# Altium schematic sheet node24-bank.SchDoc: Output Channel
size Tabloid; Author: Emergence Team; Engineer: asheem; Organization: Emergence; Address1: Oakland, California; Address2: a@aliengeometry.com; Address3: Black Rock City '18; Address4: OPEN SOURCE H/W; DocumentNumber: 3; Revision: Rev 0.1; SheetNumber: 3; SheetTotal: 6; Project: NODE24
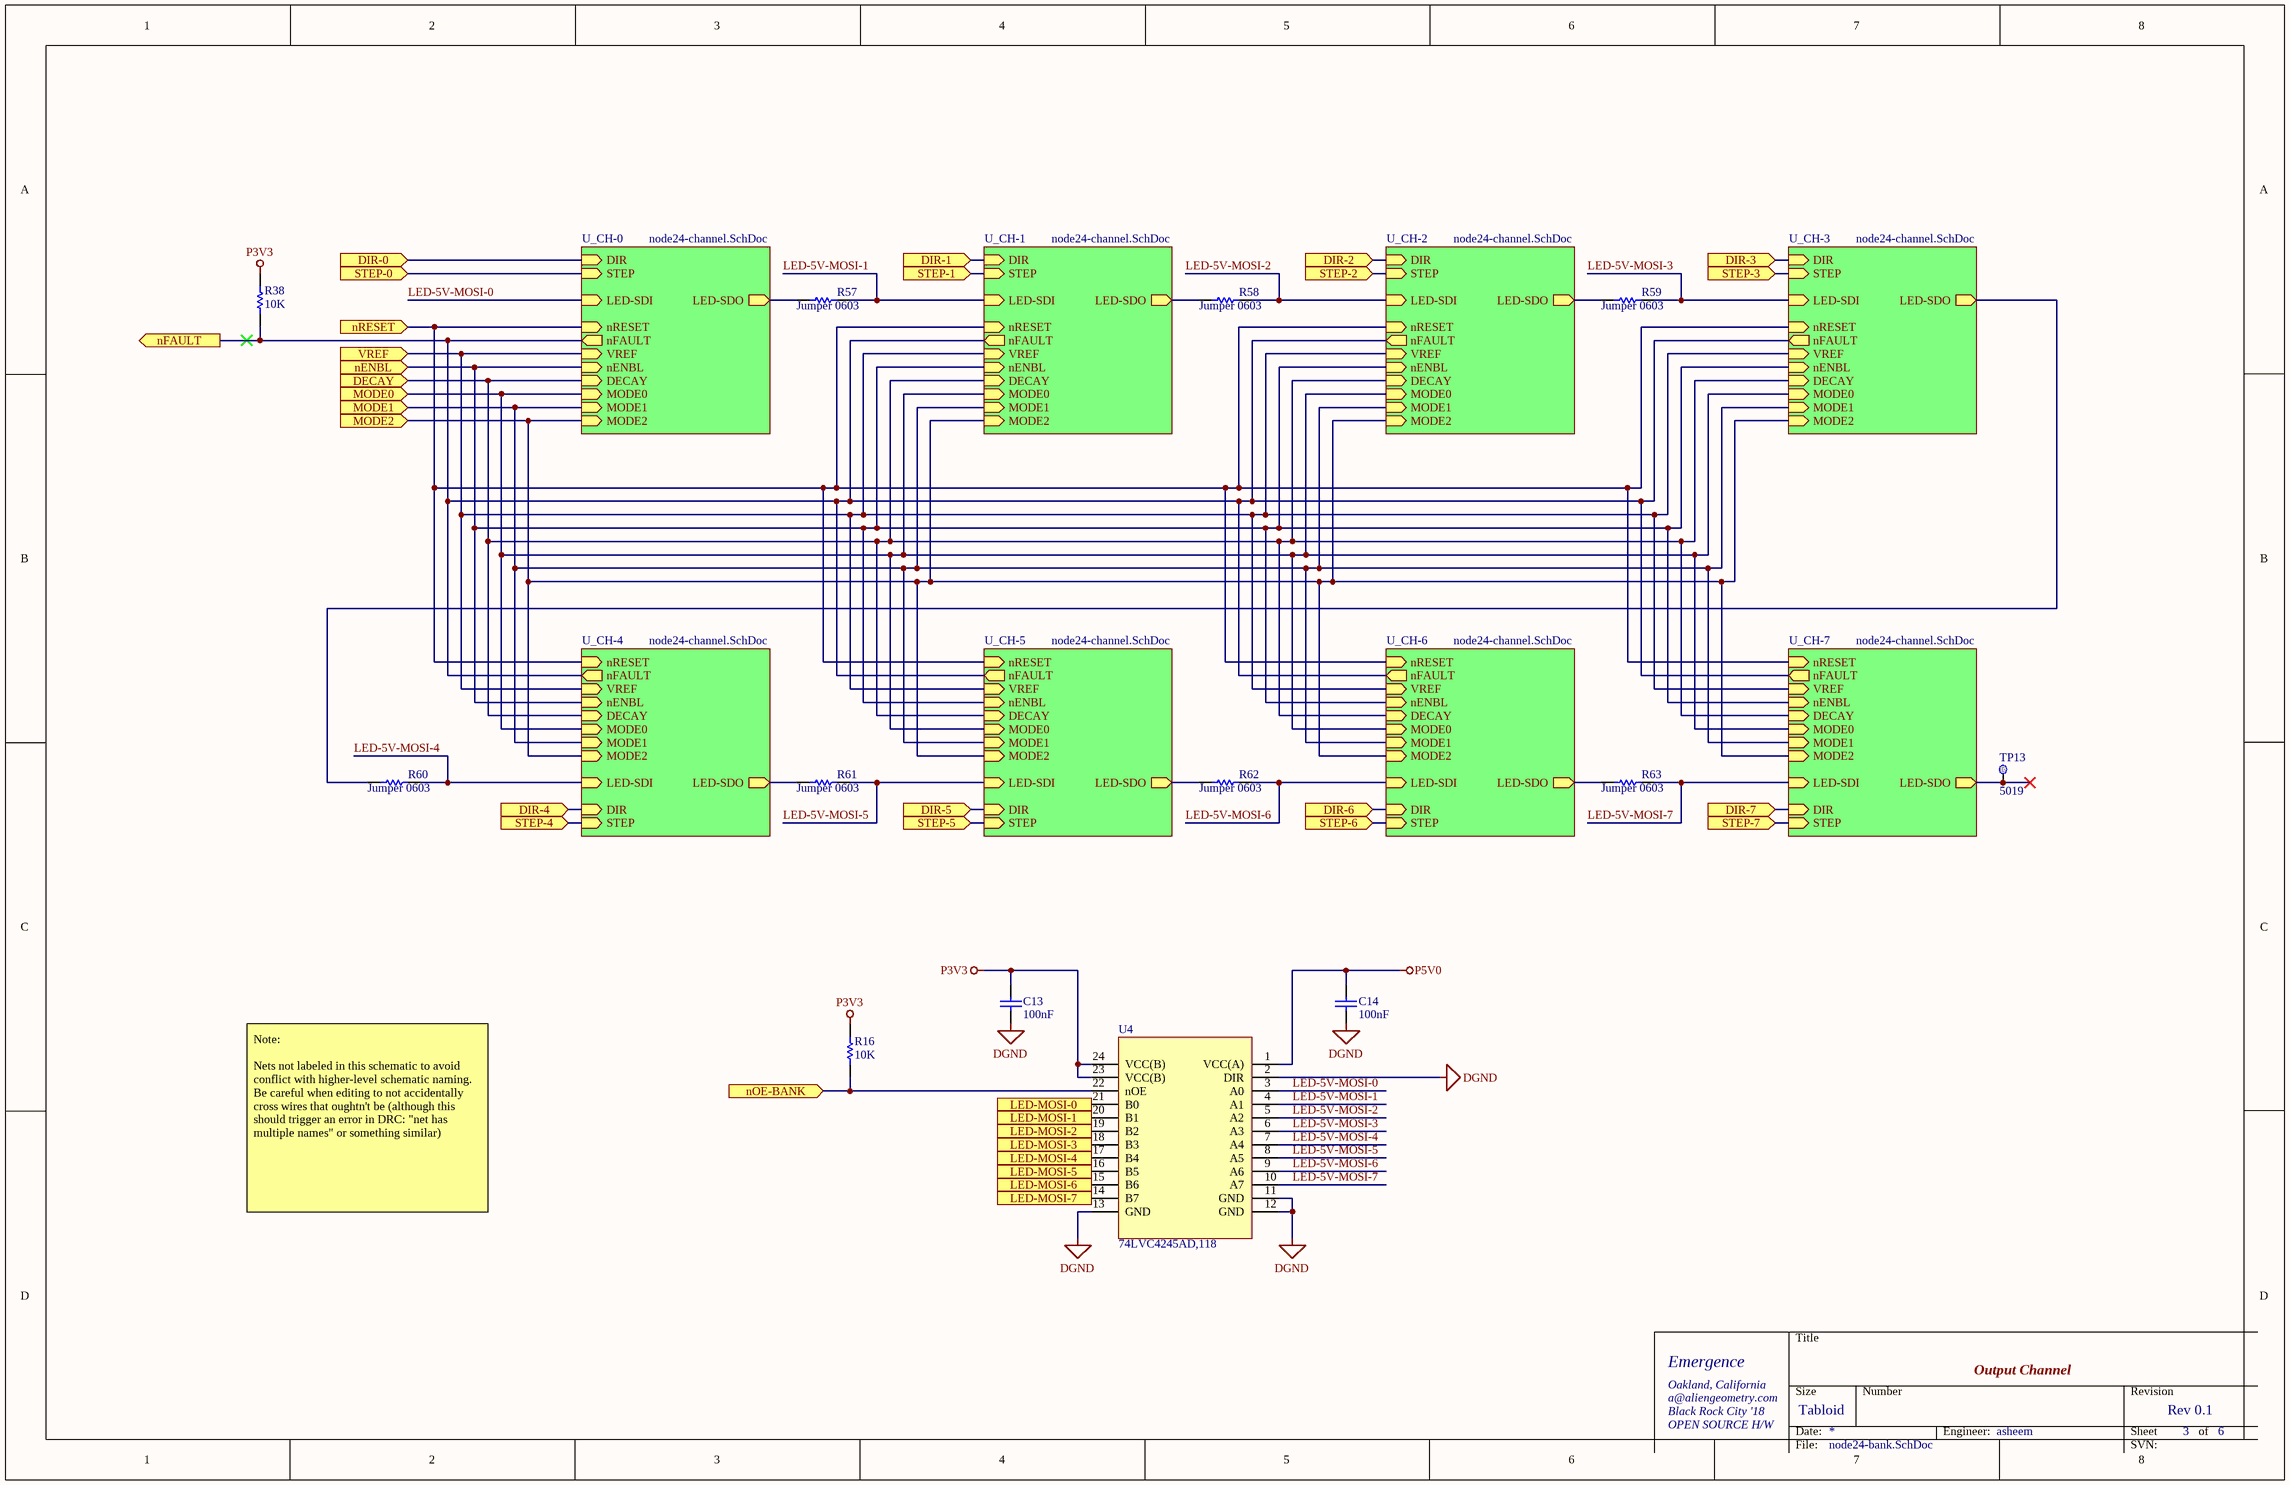
[diagram p0: node24-bank.SchDoc]

## Parts
C13  100nF  [CAPC0603(1608)100_L]
C14  100nF  [CAPC0603(1608)100_L]
R16  10K  [RESC0603(1608)_L]
R38  10K  [RESC0603(1608)_L]
R57  Jumper 0603  [RESC0603(1608)_L]
R58  Jumper 0603  [RESC0603(1608)_L]
R59  Jumper 0603  [RESC0603(1608)_L]
R60  Jumper 0603  [RESC0603(1608)_L]
R61  Jumper 0603  [RESC0603(1608)_L]
R62  Jumper 0603  [RESC0603(1608)_L]
R63  Jumper 0603  [RESC0603(1608)_L]
TP13  Manufacturer Part Number: 5019  [TEST_POINT_KEYSTONE_5019]  (hidden comment: TEST_POINT_KEYSTONE_5019_SMT)
U4  74LVC4245AD,118  [IC_TSSOP-24]

## Sub-sheets
U_CH-0 = node24-channel.SchDoc: VREF (in), nENBL (in), STEP (in), DIR (in), DECAY (in), MODE0 (in), MODE1 (in), MODE2 (in), nRESET (in), nFAULT (out), LED-SDI (in), LED-SDO (out)
U_CH-1 = node24-channel.SchDoc: VREF (in), nENBL (in), STEP (in), DIR (in), DECAY (in), MODE0 (in), MODE1 (in), MODE2 (in), nRESET (in), nFAULT (out), LED-SDI (in), LED-SDO (out)
U_CH-2 = node24-channel.SchDoc: VREF (in), nENBL (in), STEP (in), DIR (in), DECAY (in), MODE0 (in), MODE1 (in), MODE2 (in), nRESET (in), nFAULT (out), LED-SDI (in), LED-SDO (out)
U_CH-3 = node24-channel.SchDoc: VREF (in), nENBL (in), STEP (in), DIR (in), DECAY (in), MODE0 (in), MODE1 (in), MODE2 (in), nRESET (in), nFAULT (out), LED-SDI (in), LED-SDO (out)
U_CH-4 = node24-channel.SchDoc: VREF (in), nENBL (in), STEP (in), DIR (in), DECAY (in), MODE0 (in), MODE1 (in), MODE2 (in), nRESET (in), LED-SDI (in), LED-SDO (out), nFAULT (out)
U_CH-5 = node24-channel.SchDoc: VREF (in), nENBL (in), STEP (in), DIR (in), DECAY (in), MODE0 (in), MODE1 (in), MODE2 (in), nRESET (in), LED-SDI (in), LED-SDO (out), nFAULT (out)
U_CH-6 = node24-channel.SchDoc: VREF (in), nENBL (in), STEP (in), DIR (in), DECAY (in), MODE0 (in), MODE1 (in), MODE2 (in), nRESET (in), LED-SDI (in), LED-SDO (out), nFAULT (out)
U_CH-7 = node24-channel.SchDoc: VREF (in), nENBL (in), STEP (in), DIR (in), DECAY (in), MODE0 (in), MODE1 (in), MODE2 (in), nRESET (in), LED-SDI (in), LED-SDO (out), nFAULT (out)

## Ports
DECAY (in), DIR-0 (in), DIR-1 (in), DIR-2 (in), DIR-3 (in), DIR-4 (in), DIR-5 (in), DIR-6 (in), DIR-7 (in), LED-MOSI-0 (in), LED-MOSI-1 (in), LED-MOSI-2 (in), LED-MOSI-3 (in), LED-MOSI-4 (in), LED-MOSI-5 (in), LED-MOSI-6 (in), LED-MOSI-7 (in), MODE0 (in), MODE1 (in), MODE2 (in), nENBL (in), nFAULT (out), nOE-BANK (in), nRESET (in), STEP-0 (in), STEP-1 (in), STEP-2 (in), STEP-3 (in), STEP-4 (in), STEP-5 (in), STEP-6 (in), STEP-7 (in), VREF (in)

## Nets
DGND: C13.2 C14.2 U4.2(DIR) U4.11(GND) U4.12(GND) U4.13(GND)
P3V3: C13.1 R16.2 R38.2 U4.23(VCC(B)) U4.24(VCC(B))
P5V0: C14.1 U4.1(VCC(A))
DECAY: port DECAY, sheet U_CH-0/DECAY, sheet U_CH-4/DECAY, sheet U_CH-1/DECAY, sheet U_CH-5/DECAY, sheet U_CH-2/DECAY, sheet U_CH-6/DECAY, sheet U_CH-3/DECAY, sheet U_CH-7/DECAY
DIR-0: port DIR-0, sheet U_CH-0/DIR
DIR-1: port DIR-1, sheet U_CH-1/DIR
DIR-2: port DIR-2, sheet U_CH-2/DIR
DIR-3: port DIR-3, sheet U_CH-3/DIR
DIR-4: port DIR-4, sheet U_CH-4/DIR
DIR-5: port DIR-5, sheet U_CH-5/DIR
DIR-6: port DIR-6, sheet U_CH-6/DIR
DIR-7: port DIR-7, sheet U_CH-7/DIR
LED-5V-MOSI-0: U4.3(A0) ; sheet U_CH-0/LED-SDI
LED-5V-MOSI-1: R57.2 U4.4(A1) ; sheet U_CH-1/LED-SDI
LED-5V-MOSI-2: R58.2 U4.5(A2) ; sheet U_CH-2/LED-SDI
LED-5V-MOSI-3: R59.2 U4.6(A3) ; sheet U_CH-3/LED-SDI
LED-5V-MOSI-4: R60.2 U4.7(A4) ; sheet U_CH-4/LED-SDI
LED-5V-MOSI-5: R61.2 U4.8(A5) ; sheet U_CH-5/LED-SDI
LED-5V-MOSI-6: R62.2 U4.9(A6) ; sheet U_CH-6/LED-SDI
LED-5V-MOSI-7: R63.2 U4.10(A7) ; sheet U_CH-7/LED-SDI
LED-MOSI-0: U4.21(B0) ; port LED-MOSI-0
LED-MOSI-1: U4.20(B1) ; port LED-MOSI-1
LED-MOSI-2: U4.19(B2) ; port LED-MOSI-2
LED-MOSI-3: U4.18(B3) ; port LED-MOSI-3
LED-MOSI-4: U4.17(B4) ; port LED-MOSI-4
LED-MOSI-5: U4.16(B5) ; port LED-MOSI-5
LED-MOSI-6: U4.15(B6) ; port LED-MOSI-6
LED-MOSI-7: U4.14(B7) ; port LED-MOSI-7
MODE0: port MODE0, sheet U_CH-0/MODE0, sheet U_CH-4/MODE0, sheet U_CH-1/MODE0, sheet U_CH-5/MODE0, sheet U_CH-2/MODE0, sheet U_CH-6/MODE0, sheet U_CH-3/MODE0, sheet U_CH-7/MODE0
MODE1: port MODE1, sheet U_CH-0/MODE1, sheet U_CH-4/MODE1, sheet U_CH-1/MODE1, sheet U_CH-5/MODE1, sheet U_CH-2/MODE1, sheet U_CH-6/MODE1, sheet U_CH-3/MODE1, sheet U_CH-7/MODE1
MODE2: port MODE2, sheet U_CH-0/MODE2, sheet U_CH-4/MODE2, sheet U_CH-1/MODE2, sheet U_CH-5/MODE2, sheet U_CH-2/MODE2, sheet U_CH-6/MODE2, sheet U_CH-3/MODE2, sheet U_CH-7/MODE2
nENBL: port nENBL, sheet U_CH-0/nENBL, sheet U_CH-4/nENBL, sheet U_CH-1/nENBL, sheet U_CH-5/nENBL, sheet U_CH-2/nENBL, sheet U_CH-6/nENBL, sheet U_CH-3/nENBL, sheet U_CH-7/nENBL
nFAULT: R38.1 ; port nFAULT, sheet U_CH-0/nFAULT, sheet U_CH-4/nFAULT, sheet U_CH-1/nFAULT, sheet U_CH-5/nFAULT, sheet U_CH-2/nFAULT, sheet U_CH-6/nFAULT, sheet U_CH-3/nFAULT, sheet U_CH-7/nFAULT
nOE-BANK: R16.1 U4.22(nOE) ; port nOE-BANK
nRESET: port nRESET, sheet U_CH-0/nRESET, sheet U_CH-4/nRESET, sheet U_CH-1/nRESET, sheet U_CH-5/nRESET, sheet U_CH-2/nRESET, sheet U_CH-6/nRESET, sheet U_CH-3/nRESET, sheet U_CH-7/nRESET
STEP-0: port STEP-0, sheet U_CH-0/STEP
STEP-1: port STEP-1, sheet U_CH-1/STEP
STEP-2: port STEP-2, sheet U_CH-2/STEP
STEP-3: port STEP-3, sheet U_CH-3/STEP
STEP-4: port STEP-4, sheet U_CH-4/STEP
STEP-5: port STEP-5, sheet U_CH-5/STEP
STEP-6: port STEP-6, sheet U_CH-6/STEP
STEP-7: port STEP-7, sheet U_CH-7/STEP
VREF: port VREF, sheet U_CH-0/VREF, sheet U_CH-4/VREF, sheet U_CH-1/VREF, sheet U_CH-5/VREF, sheet U_CH-2/VREF, sheet U_CH-6/VREF, sheet U_CH-3/VREF, sheet U_CH-7/VREF
NetR57_1: R57.1 ; sheet U_CH-0/LED-SDO
NetR58_1: R58.1 ; sheet U_CH-1/LED-SDO
NetR59_1: R59.1 ; sheet U_CH-2/LED-SDO
NetR60_1: R60.1 ; sheet U_CH-3/LED-SDO
NetR61_1: R61.1 ; sheet U_CH-4/LED-SDO
NetR62_1: R62.1 ; sheet U_CH-5/LED-SDO
NetR63_1: R63.1 ; sheet U_CH-6/LED-SDO
NetTP13_1: TP13.1 ; sheet U_CH-7/LED-SDO

## Notes on the sheet
- Note:
  Nets not labeled in this schematic to avoid conflict with higher-level schematic naming. Be careful when editing to not accidentally cross wires that oughtn't be (although this should trigger an error in DRC: "net has multiple names" or something similar)
- Title
- Size
- Date:
- Tabloid
- Number
- Engineer:
- Revision
- Sheet
- of
- File:
- SVN:

## Library data of the parts
C13 C14 = CMP-1035-02593-1: CAP 100nF 50V ±20% 0603 (1608 Metric) Thickness 1mm SMD; Tolerance: Â±20%; Case-EIA: 0603; Case-Metric: 1608; Max Thickness: 1 mm; Value: 100nF; Technology: SMT; Rated Voltage: 50 V
R16 R38 = CMP-1012-00623-1: 10K 0.1W 1% 0603 (1608 Metric)  SMD; Value: 10000.00 Ohm; Case-EIA: 0603; Case-Metric: 1608; Power: 0.1 W; Tolerance: 1 %; Technology: SMT
R57-R63 = CMP-1012-00001-1: Jumper 0603 (1608 Metric); Case-Metric: 1608; Value: 0.00 Ohm; Power: None; Case-EIA: 0603; Technology: SMT; Tolerance: None
TP13 = TEST_POINT_KEYSTONE_5019_SMT: Circuit Board Hardware - PCB TEST POINT; Manufacturer: Keystone Electronics; Supplier 1: Digi-Key; Stock 1: 207442; Pricing 1: 1=0.38, 10=0.355, 25=0.3044, 50=0.2586, 100=0.2485, 250=0.22316, 500=0.21302 (USD); Mount: Surface Mount,PCB; Number of Pins: 1; Contact Plating: Silver; Material: Bronze; Contact Material: Bronze; Packaging: Tape and Reel; Package Quantity: 1; Termination: SMD/SMT; Height: 0.09inch; REACH SVHC: No SVHC; Lead Free: Lead Free; ComponentLink1URL: https://datasheet.ciiva.com/14848/m60-2p61-14848437.pdf; ComponentLink1Description: https://datasheet.ciiva.com/14848/m60-2p61-14848437.pdf; ComponentLink2URL: https://datasheet.ciiva.com/14848/m60-2p61-14848438.pdf; ComponentLink2Description: https://datasheet.ciiva.com/14848/m60-2p61-14848438.pdf; ComponentLink3URL: https://datasheet.ciiva.com/14848/m60-2p61-14848439.pdf; ComponentLink3Description: https://datasheet.ciiva.com/14848/m60-2p61-14848439.pdf; ComponentLink4URL: https://datasheet.ciiva.com/16885/70182998-16885945.pdf; ComponentLink4Description: https://datasheet.ciiva.com/16885/70182998-16885945.pdf; ComponentLink5URL: https://datasheet.ciiva.com/16318/m60-2p61-16318395.pdf; ComponentLink5Description: https://datasheet.ciiva.com/16318/m60-2p61-16318395.pdf; Supplier Part Number 1: 36-5019CT-ND
U4 = 74LVC4245AD,118: IC TRANSCVR TRI-ST DL 24SOIC; Manufacturer: NXP Semiconductors; Number of Channels: 8; Propagation Delay: 8ns; Min Supply Voltage: 1.5V; Max Supply Voltage: 5.5V; Number of Elements: 1; Direction: Bidirectional; Logic Function: Transceiver,Translator; Low Level Output Current: 24mA; Turn-On Delay Time: 3.6ns; Polarity: Non-Inverting; High Level Output Current: -24mA; Quiescent Current: 100nA; Output Type: TTL; Supplier 1: Digi-Key; Stock 1: 3472; Pricing 1: 1=0.63, 10=0.558, 100=0.4277, 500=0.3381 (USD); Mount: Surface Mount; Case/Package: SO; Number of Pins: 24; Contact Plating: Gold; Min Operating Temperature: -40°C; Max Operating Temperature: 125°C; Package Quantity: 1000; Packaging: Tape and Reel; Number of Bits: 8; Number of Circuits: 1; Radiation Hardening: No; REACH SVHC: No SVHC; Lead Free: Lead Free; ComponentLink1URL: https://datasheet.ciiva.com/1899/74lvc4245a-1899059.pdf; ComponentLink1Description: https://datasheet.ciiva.com/1899/74lvc4245a-1899059.pdf; ComponentLink2URL: https://datasheet.ciiva.com/1899/74lvc4245a-1899060.pdf; ComponentLink2Description: https://datasheet.ciiva.com/1899/74lvc4245a-1899060.pdf; ComponentLink3URL: https://datasheet.ciiva.com/1899/74lvc4245a-1899061.pdf; ComponentLink3Description: https://datasheet.ciiva.com/1899/74lvc4245a-1899061.pdf; ComponentLink4URL: https://datasheet.ciiva.com/8260/74lvc4245a-8260005.pdf; ComponentLink4Description: https://datasheet.ciiva.com/8260/74lvc4245a-8260005.pdf; ComponentLink5URL: https://datasheet.ciiva.com/16591/74lvc4245a-16591349.pdf; ComponentLink5Description: https://datasheet.ciiva.com/16591/74lvc4245a-16591349.pdf; ComponentLink6URL: https://datasheet.ciiva.com/46434/1714648-46434213.pdf; ComponentLink6Description: https://datasheet.ciiva.com/46434/1714648-46434213.pdf; ComponentLink7URL: https://datasheet.ciiva.com/1899/74lvc4245a-1899063.pdf; ComponentLink7Description: https://datasheet.ciiva.com/1899/74lvc4245a-1899063.pdf; Supplier Part Number 1: 1727-6369-6-ND; Manufacturer Part Number: 74LVC4245AD,118